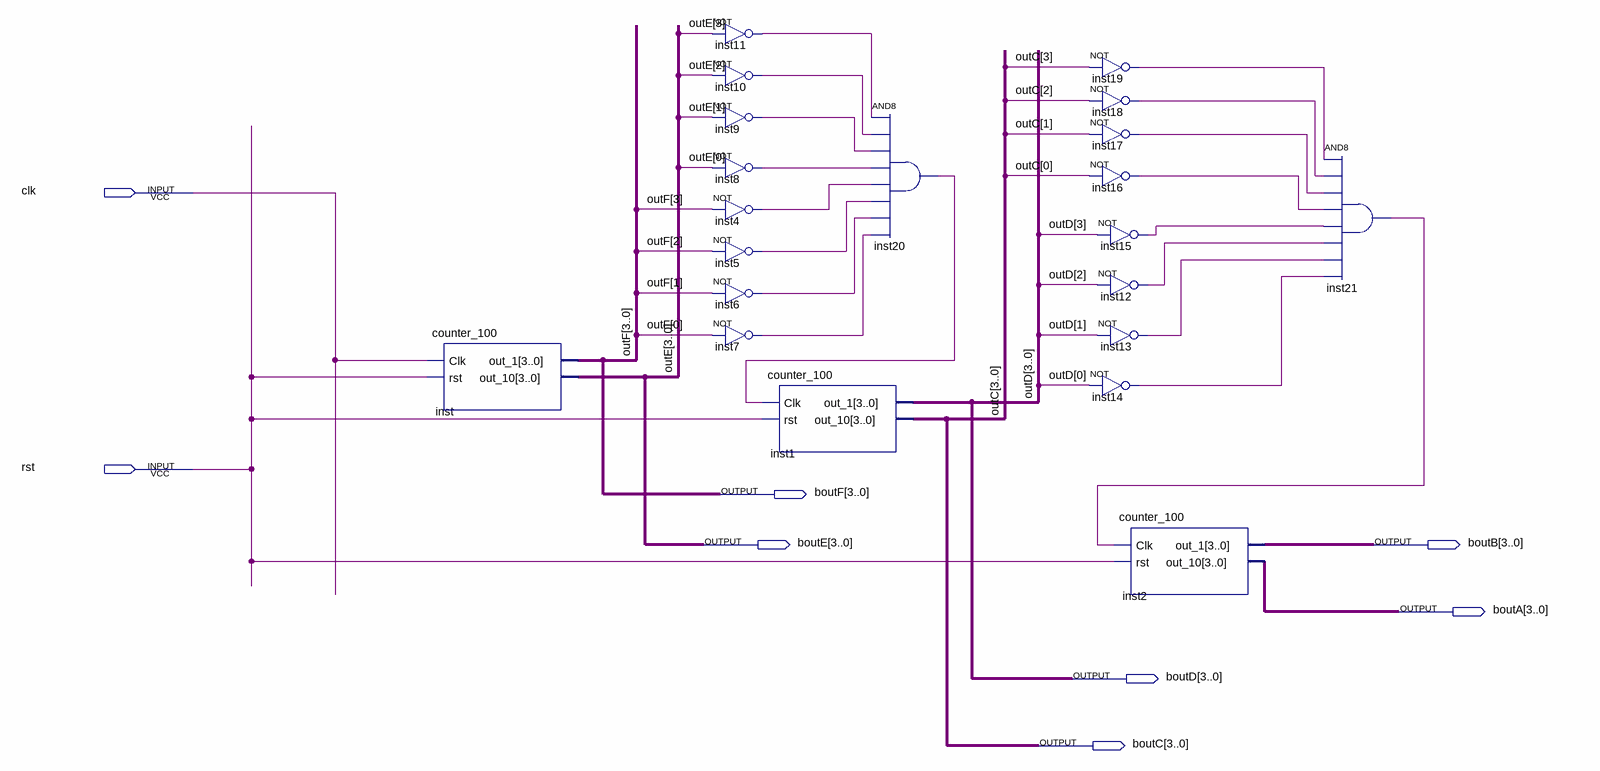
[diagram p0: schematic sheet]
// Quartus schematic count_1000000.bdf as structural Verilog: 21 symbols, 8 pins
module count_1000000 (
  input  clk,
  input  rst,
  output [3:0] boutF,
  output [3:0] boutE,
  output [3:0] boutB,
  output [3:0] boutA,
  output [3:0] boutD,
  output [3:0] boutC
);

  wire inst4_out, inst5_out, inst6_out, inst7_out, inst8_out, inst9_out, inst10_out, inst11_out, inst12_out,
       inst13_out, inst14_out, inst15_out, inst16_out, inst17_out, inst18_out, inst19_out, inst20_out,
       inst21_out;

  counter_100 inst (.Clk(clk), .rst(rst), .out_1(boutF), .out_10(boutE));
  not inst11 (inst11_out, boutE[3]);
  not inst10 (inst10_out, boutE[2]);
  not inst9 (inst9_out, boutE[1]);
  not inst8 (inst8_out, boutE[0]);
  not inst4 (inst4_out, boutF[3]);
  not inst5 (inst5_out, boutF[2]);
  not inst6 (inst6_out, boutF[1]);
  not inst7 (inst7_out, boutF[0]);
  counter_100 inst1 (.Clk(inst20_out), .rst(rst), .out_1(boutD), .out_10(boutC));
  and inst20 (inst20_out, inst11_out, inst10_out, inst9_out, inst8_out, inst4_out, inst5_out, inst6_out, inst7_out);
  not inst19 (inst19_out, boutC[3]);
  not inst18 (inst18_out, boutC[2]);
  not inst17 (inst17_out, boutC[1]);
  not inst16 (inst16_out, boutC[0]);
  not inst15 (inst15_out, boutD[3]);
  not inst12 (inst12_out, boutD[2]);
  not inst13 (inst13_out, boutD[1]);
  not inst14 (inst14_out, boutD[0]);
  counter_100 inst2 (.Clk(inst21_out), .rst(rst), .out_1(boutB), .out_10(boutA));
  and inst21 (inst21_out, inst19_out, inst18_out, inst17_out, inst16_out, inst15_out, inst12_out, inst13_out, inst14_out);

  // Other names for the same wires on the sheet: outC[3:0] = boutC; outD[3:0] = boutD; outE[3:0] = boutE;
  //   outF[3:0] = boutF
endmodule
